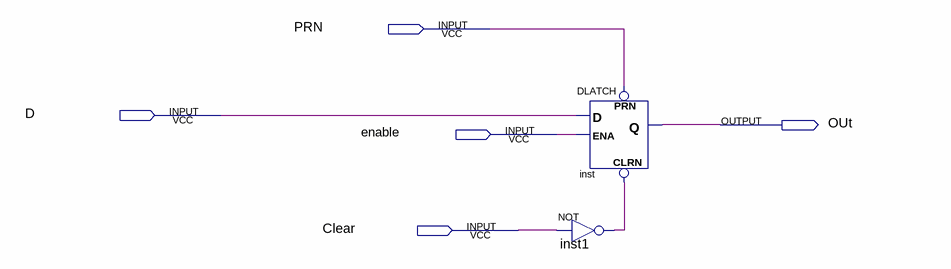
[diagram p0: schematic sheet]
// Quartus schematic TestLatch.bdf as structural Verilog: 2 symbols, 5 pins
module TestLatch (
  input  PRN,
  input  D,
  input  enable,
  input  Clear,
  output OUt
);

  wire inst1_out;

  not inst1 (inst1_out, Clear);
  DLATCH inst (.CLRN(inst1_out), .D(D), .ENA(enable), .PRN(PRN), .Q(OUt));
endmodule
